# EAGLE design servo-shield (EAGLE 7.0.0)
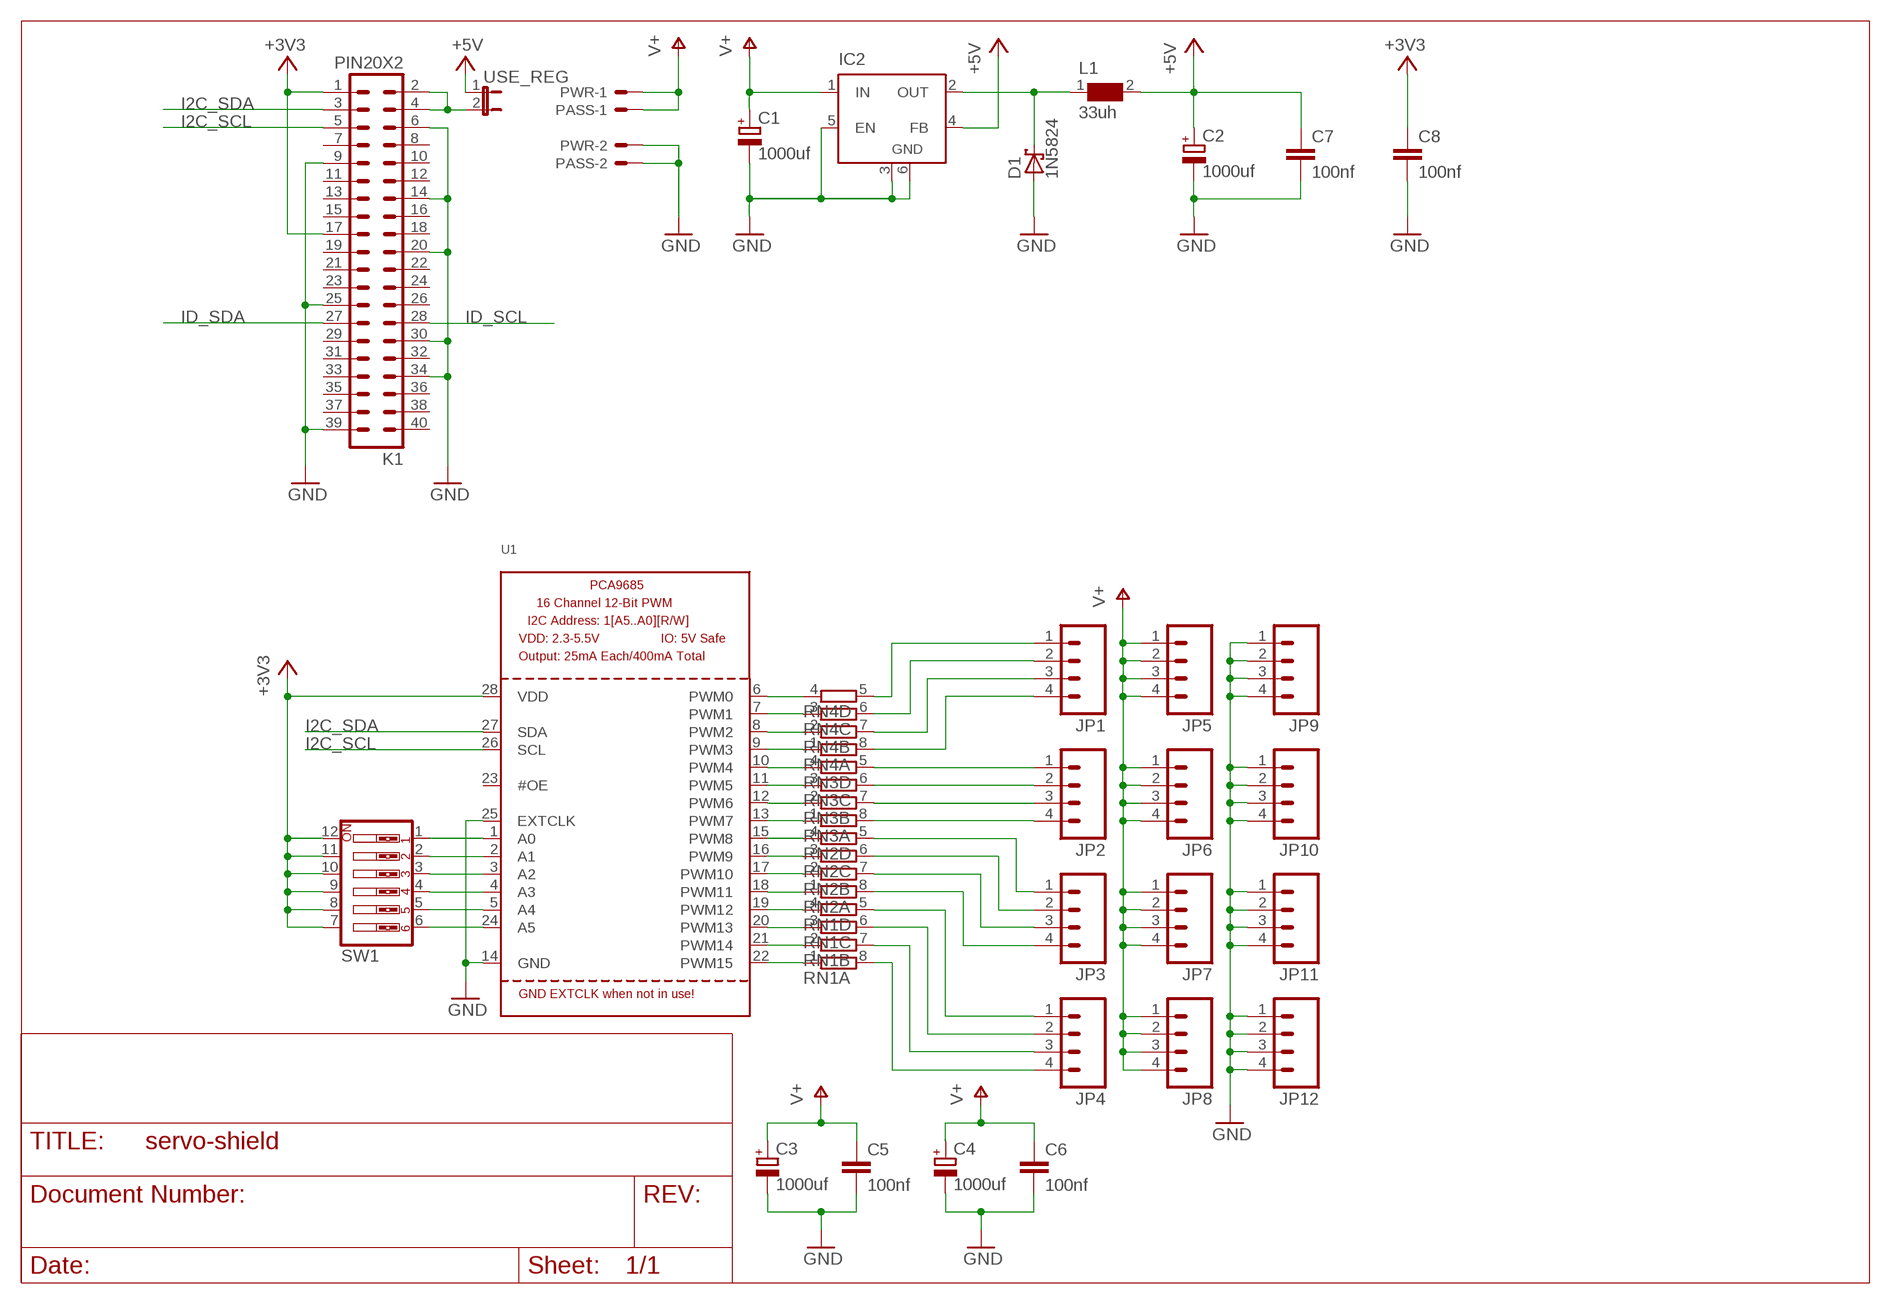
[diagram p0: schematic, sheet 1]

## Parts
C1  1000uf  CPOL-EUE3.5-8  [E3,5-8]
C2  1000uf  CPOL-EUE3.5-8  [E3,5-8]
C3  1000uf  CPOL-EUE3.5-8  [E3,5-8]
C4  1000uf  CPOL-EUE3.5-8  [E3,5-8]
C5  100nf  C-EU025-030X050  [C025-030X050]
C6  100nf  C-EU025-030X050  [C025-030X050]
C7  100nf  C-EU025-030X050  [C025-030X050]
C8  100nf  C-EU025-030X050  [C025-030X050]
D1  1N5824  1N5817-B  [DO41-7.6]
IC2  LM2596S  [TO263-5]
JP1  M04LOCK  [1X04_LOCK]
JP2  M04LOCK  [1X04_LOCK]
JP3  M04LOCK  [1X04_LOCK]
JP4  M04LOCK  [1X04_LOCK]
JP5  M04LOCK  [1X04_LOCK]
JP6  M04LOCK  [1X04_LOCK]
JP7  M04LOCK  [1X04_LOCK]
JP8  M04LOCK  [1X04_LOCK]
JP9  M04LOCK  [1X04_LOCK]
JP10  M04LOCK  [1X04_LOCK]
JP11  M04LOCK  [1X04_LOCK]
JP12  M04LOCK  [1X04_LOCK]
K1  PIN20X2  [PIN_20X2]
L1  33uh  WE-PD-744770133_1260/1245/1280/1210  [WE-PD_1260/1245/1280/1210]
PASS  22-05-7028-02  [7395-02]
PWR  22-05-7028-02  [7395-02]
RN1  4R-NEXB38V  [EXB38V]
RN2  4R-NEXB38V  [EXB38V]
RN3  4R-NEXB38V  [EXB38V]
RN4  4R-NEXB38V  [EXB38V]
SW1  SW_DIP-6  [EDG-06]
U1  PCA9685  [TSSOP28]
USE_REG  JP1E  [JP1]

## Nets
+3V3: C8.1 K1.1 K1.17 SW1.7 SW1.8 SW1.9 SW1.10 SW1.11 SW1.12 U1.28(VDD)
+5V: C2.+ C7.1 IC2.4(FB) L1.2 USE_REG.1
GND: C1.- C2.- C3.- C4.- C5.2 C6.2 C7.2 C8.2 D1.A IC2.3(GND) IC2.5(EN) IC2.6(GND) JP9.1 JP9.2 JP9.3 JP9.4 JP10.1 JP10.2 JP10.3 JP10.4 JP11.1 JP11.2 JP11.3 JP11.4 JP12.1 JP12.2 JP12.3 JP12.4 K1.6 K1.9 K1.14 K1.20 K1.25 K1.30 K1.34 K1.39 PASS.2 PWR.2 U1.14(GND) U1.25(EXTCLK)
I2C_SCL: K1.5 U1.26(SCL)
I2C_SDA: K1.3 U1.27(SDA)
ID_SCL: K1.28
ID_SDA: K1.27
N$1: RN2.3 U1.16(PWM9)
N$2: RN2.4 U1.15(PWM8)
N$3: RN3.1 U1.13(PWM7)
N$4: SW1.6 U1.24(A5)
N$5: JP1.4 RN4.8
N$6: JP1.3 RN4.7
N$7: JP1.2 RN4.6
N$8: JP1.1 RN4.5
N$9: JP3.1 RN2.5
N$10: JP3.2 RN2.6
N$11: SW1.1 U1.1(A0)
N$12: SW1.2 U1.2(A1)
N$13: SW1.5 U1.5(A4)
N$14: SW1.3 U1.3(A2)
N$15: SW1.4 U1.4(A3)
N$16: K1.2 K1.4 USE_REG.2
N$17: JP3.3 RN2.7
N$18: JP3.4 RN2.8
N$19: JP4.1 RN1.5
N$20: JP4.2 RN1.6
N$21: JP4.3 RN1.7
N$22: JP4.4 RN1.8
N$23: RN1.1 U1.22(PWM15)
N$24: RN1.2 U1.21(PWM14)
N$25: RN1.3 U1.20(PWM13)
N$26: RN1.4 U1.19(PWM12)
N$27: RN2.1 U1.18(PWM11)
N$28: RN2.2 U1.17(PWM10)
N$29: RN3.2 U1.12(PWM6)
N$30: RN3.3 U1.11(PWM5)
N$31: RN3.4 U1.10(PWM4)
N$32: RN4.1 U1.9(PWM3)
N$33: RN4.2 U1.8(PWM2)
N$34: RN4.3 U1.7(PWM1)
N$35: RN4.4 U1.6(PWM0)
N$36: JP2.1 RN3.5
N$37: JP2.4 RN3.8
N$38: JP2.3 RN3.7
N$39: JP2.2 RN3.6
V+: C1.+ C3.+ C4.+ C5.1 C6.1 IC2.1(IN) JP5.1 JP5.2 JP5.3 JP5.4 JP6.1 JP6.2 JP6.3 JP6.4 JP7.1 JP7.2 JP7.3 JP7.4 JP8.1 JP8.2 JP8.3 JP8.4 PASS.1 PWR.1
VOUT: D1.C IC2.2(OUT) L1.1
Unconnected: K1.7 K1.8 K1.10 K1.11 K1.12 K1.13 K1.15 K1.16 K1.18 K1.19 K1.21 K1.22 K1.23 K1.24 K1.26 K1.29 K1.31 K1.32 K1.33 K1.35 K1.36 K1.37 K1.38 K1.40 U1.23(#OE)

## Library data of the parts
C1-C4 = rcl:CPOL-EU: POLARIZED CAPACITOR, European symbol
C5-C8 = rcl:C-EU: CAPACITOR, European symbol
D1 = diode:1N581*: 1.0A SCHOTTKY BARRIER RECTIFIER Source: http://www.diodes.com/datasheets/ds23001.pdf
IC2 = linear:LM2596S: STEP-DOWN VOLTAGE REGULATOR
JP1-JP12 = SparkFun-Connectors:M04: Header 4 Standard 4-pin 0.1" header. Use with straight break away headers (SKU : PRT-00116), right angle break away headers (PRT-00553), swiss pins (PRT-00743), machine pins (PRT-00117), and female headers (PRT-00115). Molex polarized connector foot print use with SKU : PRT-08231 with associated crimp pins and housings. 1MM SMD Version SKU: PRT-10208
K1 = FLYFISH:PIN20X2
L1 = WE-PD:WE-PD: SMD-Shielded Power Inductors WE-PD - Magnetically shielded version which results in a low leakage field - High storage capacity - Low self-losses - Highest possible current loading for SMD-Inducors -- Switching regulators with low operating voltages (computer, laptop, mobile phones, pagers) -- Integrated DC/DC-converter -- Is recommended for the application with switching regulators from National Semiconductor, Linear Technology, Texas Instruments and Fairchild Semiconductor, ect. -- Graphic cards -- Plastic base: Because of the one piece construction these are more suitable for high vibration or shock applications; MPN: 744770133; OC_FARNELL: 2082596; OC_NEWARK: 88T7068; PACKAGE: 1280; SUPPLIER: Wuerth Elektronik
PASS PWR = con-molex:22-?-02: CONNECTOR wire to board 2.54 mm (.1 inch) pitch header; OC_FARNELL: 9731601; OC_NEWARK: unknown
RN1-RN4 = resistor-dil:4R-N: Array Chip Resistor Source: RS Component / Phycomp; OC_FARNELL: unknown; OC_NEWARK: unknown
SW1 = special:SW_DIP-6: DIP SWITCH
U1 = adafruit:PCA9685: PCA9685 - 16 Channel 12-Bit I2C PWM Controller 5.0V tolerant 16 channel, 12-bit I2C PWM controller with 25mA per output (max. 400mA total) Digikey: 568-5931-1-ND
USE_REG = jumper:JP1E: JUMPER

## Board
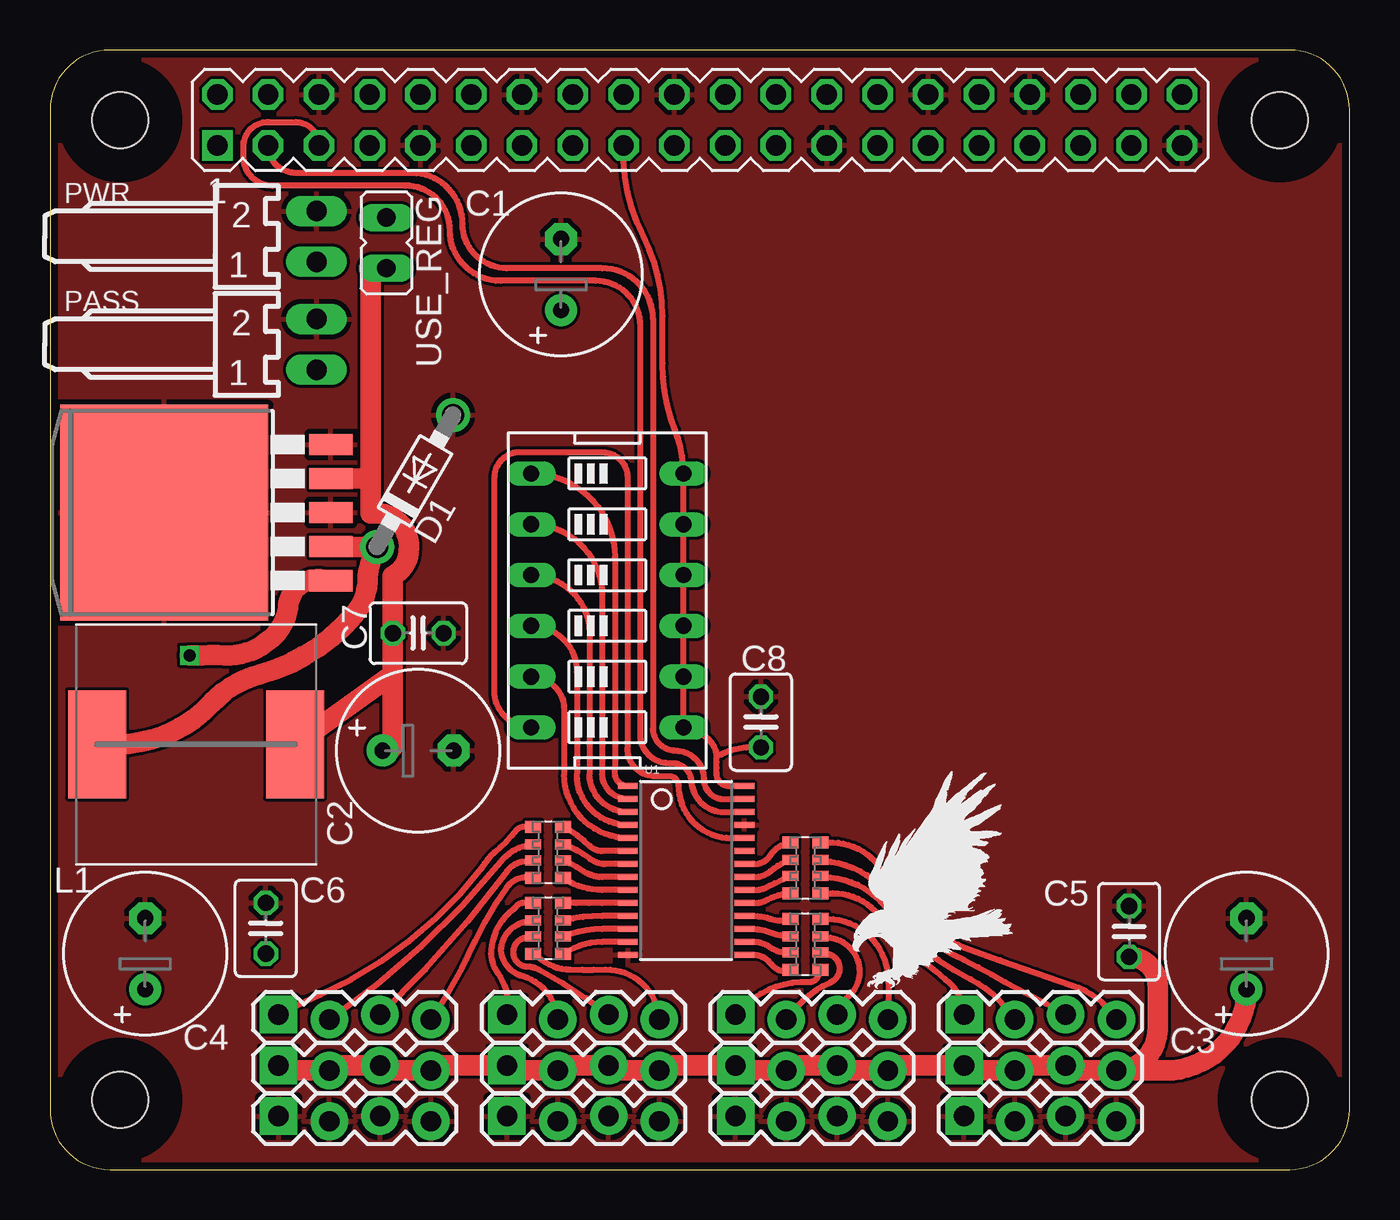
[diagram p1: board, top side]
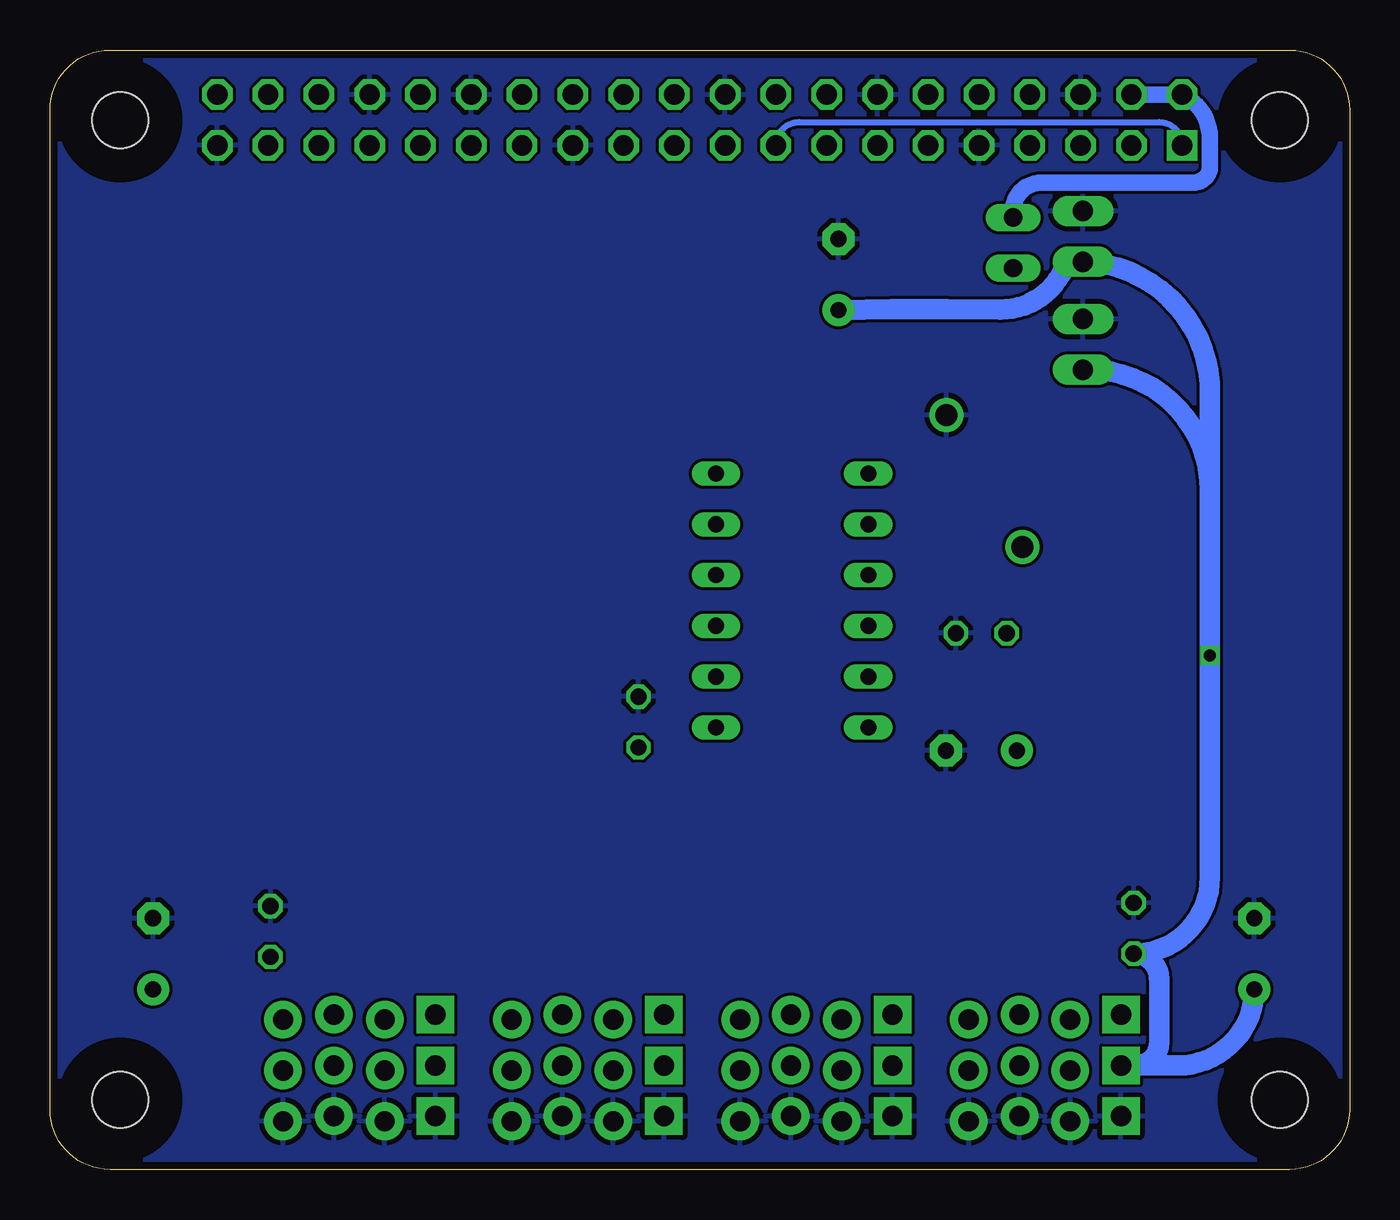
[diagram p2: board, bottom side, seen from below]

Size 65 x 56 mm. Coordinates in mm from the lower left corner, seen from the top.
Outline: 0,3 arc90 3,0 62,0 arc90 65,3 65,53 arc90 62,56 3,56 arc90 0,53 0,3
Copper layers (1*16): Top 0.0356mm / dielectric 1.5011mm / Bottom 0.0356mm
Design rules "LaenPCBOrder": minimum track width 6mil, minimum drill 13mil, track to track 6mil, track to pad 6mil, pad to pad 6mil, via to via 6mil, smd to smd 6mil, copper to edge 15mil, drill to drill 6mil, minimum pad ring 7mil, minimum via ring 7mil, stop-mask expansion 3mil, vias tented up to drill 0mil, thermal gap 10mil
Holes 2.8 mm at 3.5,3.5 3.5,52.5 61.5,52.5 61.5,3.5
tRestrict: area 1.9,51 to 5,54; area 60,51 to 63,54; area 60,1.9 to 63,5; area 1.9,1.9 to 5,5
bRestrict: area 1.9,1.9 to 5,5; area 1.9,51 to 5,54; area 60,1.9 to 63,5; area 60,51 to 63,54

### Footprints (pad centres in the part's own frame; a part is rotated, then mirrored left to right if it is on the bottom)
E3,5-8 = drill 0.813 pad 1.6: + -1.778,0 | drill 0.813 pad 1.6 octagon: - 1.778,0
C025-030X050 = drill 0.813 octagon: 1 -1.27,0; 2 1.27,0
DO41-7.6 = drill 1.1 pad 1.7: A 3.81,0; C -3.81,0
TO263-5 = smd 1.067 x 2.159: 1 -3.404,-5.791; 2 -1.702,-5.791; 3 0,-5.791; 4 1.702,-5.791; 5 3.404,-5.791 | smd 10.8 x 10.41: 6 0,2.54
1X04_LOCK = drill 1.016 pad 1.88 square: 1 0,0.127 | drill 1.016 pad 1.88: 2 2.54,-0.127; 3 5.08,0.127; 4 7.62,-0.127
PIN_20X2 = drill 1.016 square: 1 -24.13,-1.27 | drill 1.016 octagon: 2 -24.13,1.27; 3 -21.59,-1.27; 4 -21.59,1.27; 5 -19.05,-1.27; 6 -19.05,1.27; 7 -16.51,-1.27; 8 -16.51,1.27; 9 -13.97,-1.27; 10 -13.97,1.27; 11 -11.43,-1.27; 12 -11.43,1.27; 13 -8.89,-1.27; 14 -8.89,1.27; 15 -6.35,-1.27; 16 -6.35,1.27; 17 -3.81,-1.27; 18 -3.81,1.27; 19 -1.27,-1.27; 20 -1.27,1.27; 21 1.27,-1.27; 22 1.27,1.27; 23 3.81,-1.27; 24 3.81,1.27; 25 6.35,-1.27; 26 6.35,1.27; 27 8.89,-1.27; 28 8.89,1.27; 29 11.43,-1.27; 30 11.43,1.27; 31 13.97,-1.27; 32 13.97,1.27; 33 16.51,-1.27; 34 16.51,1.27; 35 19.05,-1.27; 36 19.05,1.27; 37 21.59,-1.27; 38 21.59,1.27; 39 24.13,-1.27; 40 24.13,1.27
WE-PD_1260/1245/1280/1210 = smd 2.9 x 5.4: 1 -4.95,0; 2 4.95,0
7395-02 = drill 1.016 long: 1 1.27,0; 2 -1.27,0
EXB38V = smd 0.6 x 0.8: 1 -1.275,-0.75; 4 1.275,-0.75; 5 1.275,0.75; 8 -1.275,0.75 | smd 0.5 x 0.8: 2 -0.4,-0.75; 3 0.4,-0.75; 6 0.4,0.75; 7 -0.4,0.75
EDG-06 = drill 0.813 long: 1 -6.35,-3.81; 2 -3.81,-3.81; 3 -1.27,-3.81; 4 1.27,-3.81; 5 3.81,-3.81; 6 6.35,-3.81; 7 6.35,3.81; 8 3.81,3.81; 9 1.27,3.81; 10 -1.27,3.81; 11 -3.81,3.81; 12 -6.35,3.81
TSSOP28 = smd 0.305 x 0.991: 1 -4.225,-2.918; 2 -3.575,-2.918; 3 -2.925,-2.918; 4 -2.275,-2.918; 5 -1.625,-2.918; 6 -0.975,-2.918; 7 -0.325,-2.918; 8 0.325,-2.918; 9 0.975,-2.918; 10 1.625,-2.918; 11 2.275,-2.918; 12 2.925,-2.918; 13 3.575,-2.918; 14 4.225,-2.918; 15 4.225,2.918; 16 3.575,2.918; 17 2.925,2.918; 18 2.275,2.918; 19 1.625,2.918; 20 0.975,2.918; 21 0.325,2.918; 22 -0.325,2.918; 23 -0.975,2.918; 24 -1.625,2.918; 25 -2.275,2.918; 26 -2.925,2.918; 27 -3.575,2.918; 28 -4.225,2.918
JP1 = drill 0.914 long: 1 0,-1.27; 2 0,1.27

### Placement (x,y rotation side)
C1  25.56,44.77 90 top
C2  18.41,20.95 0 top
C3  59.85,10.79 90 top
C4  4.76,10.79 90 top
C5  53.98,11.91 90 top
C6  10.79,12.06 90 top
C7  18.41,26.83 0 top
C8  35.56,22.38 90 top
D1  18.26,34.45 60 top
IC2  8.26,32.86 90 top
JP1  11.43,7.62 0 top
JP2  22.86,7.62 0 top
JP3  34.29,7.62 0 top
JP4  45.72,7.62 0 top
JP5  11.43,5.08 0 top
JP6  22.86,5.08 0 top
JP7  34.29,5.08 0 top
JP8  45.72,5.08 0 top
JP9  11.43,2.54 0 top
JP10  22.86,2.54 0 top
JP11  34.29,2.54 0 top
JP12  45.72,2.54 0 top
K1  32.5,52.5 0 top
L1  7.3,21.27 0 top
PASS  13.34,41.27 270 top
PWR  13.34,46.67 270 top
RN1  37.78,15.08 270 top
RN2  37.78,11.27 270 top
RN3  24.92,12.06 90 top
RN4  24.92,15.88 90 top
SW1  27.88,28.46 270 top
U1  31.82,14.96 270 top
U$1  [EAGLE-PLC-8MM]  40.16,9.05 0 top
USE_REG  16.83,46.35 0 top

### Tracks (layer width: path | path; a pad name or v marks a point on that pad's centre or on a via)
+3V3
  Top 0.305: K1.17 arc29 29.69,46.67 arc-27 30.64,42.7 30.64,40.32 arc22 31.27,36.99 arc-22 SW1.12 SW1.11 SW1.10 SW1.9 SW1.8 SW1.7 arc94 31.91,21.91 arc-91 33.34,20.64 | U1.28 33.97,19.18 arc-93 33.34,19.84 arc5 33.34,20.64 | C8.1 35.08,21.11 arc31 33.34,20.64
  Bottom 0.305: K1.17 arc90 27.53,52.39 9.53,52.39 arc90 K1.1
+5V
  Top 1.016: C2.+ arc90 17.14,21.14 17.14,24.77 | 17.14,24.77 C7.1 17.14,29.69 arc62 17.94,30.96 arc90 16.55,32.82 16.03,32.82 16.03,34.56 | L1.2 17.14,24.77 | IC2.4 16.03,34.56 | 16.03,34.56 16.03,45.09 USE_REG.1
GND
  pour Bottom: 0,3 arc90 3,0 62,0 arc90 65,3 65,53 arc90 62,56 3,56 arc90 0,53
  pour Top: 0,3 arc90 3,0 62,0 arc90 65,3 65,53 arc90 62,56 3,56 arc90 0,53 0.05,36.82
I2C_SCL
  Top 0.305: K1.5 arc90 12.29,52.39 10.95,52.39 arc90 9.68,51.28 9.68,50.64 arc90 11.11,49.21 17.78,49.21 arc-90 20,46.99 arc90 22.54,44.45 27.3,44.45 arc-90 29.53,42.23 29.53,21.75 arc90 30.96,20.32 arc-90 32.07,19.53 arc90 33.71,17.88 U1.26
I2C_SDA
  Top 0.305: K1.3 arc90 12.29,49.85 18.1,49.85 arc-90 20.64,47.31 arc90 22.86,45.09 27.62,45.09 arc-90 30.16,42.55 30.16,22.07 arc90 31.27,20.95 arc-90 32.7,19.53 arc90 33.7,18.53 U1.27
N$1
  Top 0.305: U1.16 35.24,11.38 arc-37 36.04,11.11 arc47 RN2.3
N$2
  Top 0.305: U1.15 35.24,10.73 arc-43 35.88,10.48 arc-3 36.2,10.16 arc71 RN2.4
N$3
  Top 0.305: U1.13 27.62,11.38 arc34 RN3.1
N$4
  Top 0.305: SW1.6 arc-90 22.23,23.96 22.23,34.61 arc-90 23.5,35.88 27.62,35.88 arc-90 28.89,34.61 28.89,21.11 arc90 30.16,19.68 30.96,19.68 arc-90 31.43,19.21 arc90 34.06,16.58 U1.24
N$5
  Top 0.305: RN4.8 23.81,14.61 arc55 22.86,14.13 arc11 21.27,11.43 arc-9 JP1.4
N$6
  Top 0.305: RN4.7 23.65,15.4 arc45 22.86,14.92 arc-10 JP1.3
N$7
  Top 0.305: RN4.6 23.81,16.19 arc38 22.54,15.4 arc-17 JP1.2
N$8
  Top 0.305: RN4.5 23.81,17.14 arc52 23.34,16.99 arc-15 22.23,15.88 arc15 21.59,15.08 arc-28 13.49,8.73 arc3 JP1.1
N$9
  Top 0.305: RN2.5 38.42,9.68 arc-72 37.94,9.37 arc53 JP3.1
N$10
  Top 0.305: RN2.6 38.89,10.79 arc-143 39.05,9.37 arc31 JP3.2
N$11
  Top 0.305: U1.1 arc-90 28.26,19.82 28.26,20.16 28.26,30.62 arc90 SW1.1
N$12
  Top 0.305: U1.2 arc-90 27.62,19.81 27.62,28.72 arc90 SW1.2
N$13
  Top 0.305: U1.5 arc-90 25.72,19.77 25.72,23 arc90 SW1.5
N$14
  Top 0.305: U1.3 arc-90 26.99,19.8 26.99,26.82 arc90 SW1.3
N$15
  Top 0.305: U1.4 arc-90 26.35,19.78 26.35,24.91 arc90 SW1.4
N$16
  Bottom 0.813: K1.4 K1.2 arc65 6.99,51.59 6.99,50.16 arc90 7.78,49.37 15.4,49.37 arc-90 16.83,47.94 USE_REG.2
N$17
  Top 0.305: RN2.7 39.05,11.59 arc-132 39.85,8.57 arc43 JP3.3
N$18
  Top 0.305: RN2.8 38.89,12.54 arc-85 41.91,9.68 arc-8 JP3.4
N$19
  Top 0.305: RN1.5 38.89,13.81 arc-60 41.59,12.54 arc29 43.34,10.64 arc-6 44.77,9.53 arc-50 JP4.1
N$20
  Top 0.305: RN1.6 39.05,14.61 arc-45 41.75,13.18 arc28 46.04,9.53 arc-31 JP4.2
N$21
  Top 0.305: RN1.7 39.05,15.4 arc-49 42.23,13.34 arc25 43.18,12.38 arc-25 43.66,11.91 arc25 44.29,11.27 arc6 45.72,10.48 arc-4 47.78,9.37 arc-3 JP4.3
N$22
  Top 0.305: RN1.8 38.89,16.35 arc-52 41.27,15.4 arc5 44.13,12.22 arc29 45.72,11.11 arc1 51.12,9.21 arc-42 JP4.4
N$23
  Top 0.305: U1.22 35.24,15.28 arc58 36.04,15.72 arc-50 RN1.1
N$24
  Top 0.305: U1.21 35.24,14.63 arc40 36.04,14.92 arc-22 RN1.2
N$25
  Top 0.305: U1.20 35.24,13.98 arc26 35.88,14.13 arc-2 RN1.3
N$26
  Top 0.305: U1.19 35.24,13.33 arc29 35.88,13.49 arc-28 RN1.4
N$27
  Top 0.305: U1.18 35.24,12.68 arc-20 36.04,12.54 arc40 RN2.1
N$28
  Top 0.305: U1.17 35.24,12.03 arc-22 35.88,11.91 arc21 RN2.2
N$29
  Top 0.305: U1.12 27.62,12.03 arc21 RN3.2
N$30
  Top 0.305: U1.11 27.62,12.68 arc13 RN3.3
N$31
  Top 0.305: U1.10 27.62,13.33 arc-1 RN3.4
N$32
  Top 0.305: U1.9 27.62,13.98 arc-24 26.19,14.29 arc-13 RN4.1
N$33
  Top 0.305: U1.8 27.62,14.63 arc-34 26.67,14.92 arc10 RN4.2
N$34
  Top 0.305: U1.7 27.78,15.28 arc-39 26.99,15.56 arc13 RN4.3
N$35
  Top 0.305: U1.6 27.62,15.93 arc-45 26.99,16.19 arc18 RN4.4
N$36
  Top 0.305: RN3.5 23.65,13.34 arc52 23.34,13.18 arc-15 23.18,13.02 arc49 22.07,10.95 arc40 22.38,9.84 arc-46 JP2.1
N$37
  Top 0.305: RN3.8 24.61,10.48 arc35 26.04,10 arc2 27.78,10 arc-88 JP2.4
N$38
  Top 0.305: RN3.7 23.81,11.59 arc169 23.81,10.16 arc-30 24.45,10 arc-10 JP2.3
N$39
  Top 0.305: RN3.6 23.81,12.38 arc79 22.54,10.95 arc71 23.65,9.68 arc-68 JP2.2
V+  (via drill 0.6)
  Top 1.016: JP8.4 51.05,4.95 JP8.3 48.51,5.21 JP8.2 45.97,4.95 JP8.1 42.16,5.21 JP7.4 39.62,4.95 JP7.3 37.08,5.21 JP7.2 34.54,4.95 JP7.1 30.73,5.21 JP6.4 28.19,4.95 JP6.3 25.65,5.21 JP6.2 22.86,4.95 JP6.1 19.3,5.21 JP5.4 16.76,4.95 JP5.3 14.22,5.21 JP5.2 11.68,4.95 JP5.1 | IC2.1 13.49,29.53 arc93 11.91,28.1 arc-49 10.79,26.35 arc-40 8.73,25.72 arc6 7.62,25.72 arc-6 v6.99,25.72 | JP8.4 55.78,4.95 arc90 C3.+ | JP8.4 arc90 55.4,7.02 55.4,9.21 arc90 C5.1
  Bottom 1.016: C4.+ arc90 8.57,5.21 JP5.1 10.67,5.21 arc-90 9.53,6.35 9.53,9.53 arc-90 C6.1 arc-90 6.99,14.61 v6.99,25.72 6.99,33.97 | 6.99,33.97 6.99,38.73 arc-90 PWR.1 arc-62 14.45,44.77 arc62 17.46,43.02 arc-2 C1.+ | PASS.1 13.02,40.01 arc90 6.99,33.97
VOUT
  Top 1.016: L1.1 3.33,21.27 arc47 8.1,23.34 arc-32 10.48,24.77 arc35 15.24,27.78 arc37 15.88,29.37 arc-27 D1.C IC2.2